# Altium schematic sheet Conectores.SchDoc: **
size A4; Author: **; CompanyName: Introducción al Diseño de Circuitos Impresos; Organization: UTN FRBA; Revision: **
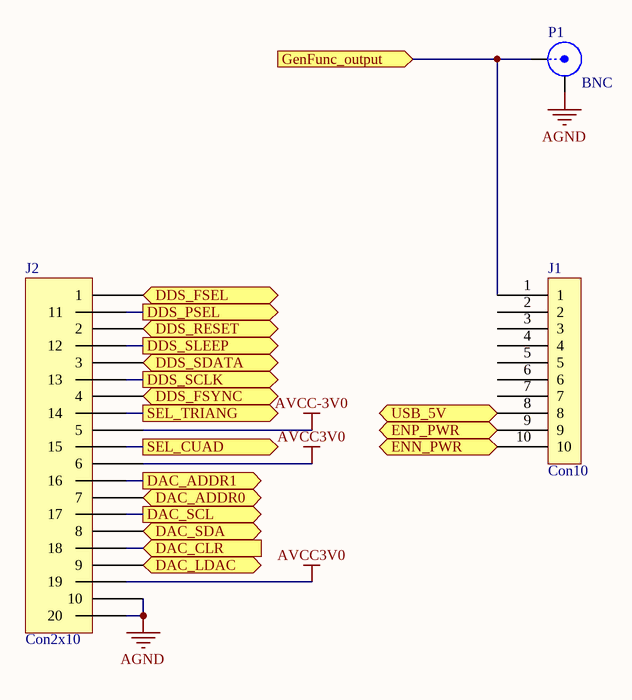
[diagram p0: Conectores.SchDoc]

## Parts
J1  Con10  [Connector .1 x10]
J2  Con2x10  [Con2x10]
P1  BNC  [BNC]

## Ports
DAC_ADDR0 (out), DAC_ADDR1 (out), DAC_CLR (in), DAC_LDAC (out), DAC_SCL (out), DAC_SDA (bidir), DDS_FSEL (out), DDS_FSYNC (out), DDS_PSEL (out), DDS_RESET (out), DDS_SCLK (out), DDS_SDATA (out), DDS_SLEEP (out), ENN_PWR (out), ENP_PWR (out), GenFunc_output (in), SEL_CUAD (out), SEL_TRIANG (out), USB_5V (out)

## Nets
AGND: J2.10 J2.20 P1.2(Y)
AVCC3V0: J2.6 J2.19
AVCC-3V0: J2.5
DAC_ADDR0: J2.7 ; port DAC_ADDR0
DAC_ADDR1: J2.16 ; port DAC_ADDR1
DAC_CLR: J2.18 ; port DAC_CLR
DAC_LDAC: J2.9 ; port DAC_LDAC
DAC_SCL: J2.17 ; port DAC_SCL
DAC_SDA: J2.8 ; port DAC_SDA
DDS_FSEL: J2.1 ; port DDS_FSEL
DDS_FSYNC: J2.4 ; port DDS_FSYNC
DDS_PSEL: J2.11 ; port DDS_PSEL
DDS_RESET: J2.2 ; port DDS_RESET
DDS_SCLK: J2.13 ; port DDS_SCLK
DDS_SDATA: J2.3 ; port DDS_SDATA
DDS_SLEEP: J2.12 ; port DDS_SLEEP
ENN_PWR: J1.10 ; port ENN_PWR
ENP_PWR: J1.9 ; port ENP_PWR
GenFunc_output: J1.1 P1.1(X) ; port GenFunc_output
SEL_CUAD: J2.15 ; port SEL_CUAD
SEL_TRIANG: J2.14 ; port SEL_TRIANG
USB_5V: J1.8 ; port USB_5V

Not connected (* = marked no-connect by the designer): J1 2 3 4 5 6 7

## Notes on the sheet
- Title:
- Size:
- Author:
- A4
- Sheet
- of
- Revision:
- File:
- Date:

## Library data of the parts
J1 = Con10: Connector x10
J2 = Con2x10: Connector 2x10
P1 = BNC: BNC Elbow Connector; LatestRevisionDate: 17-Jul-2002; LatestRevisionNote: Re-released for DXP Platform.; Publisher: Altium Limited